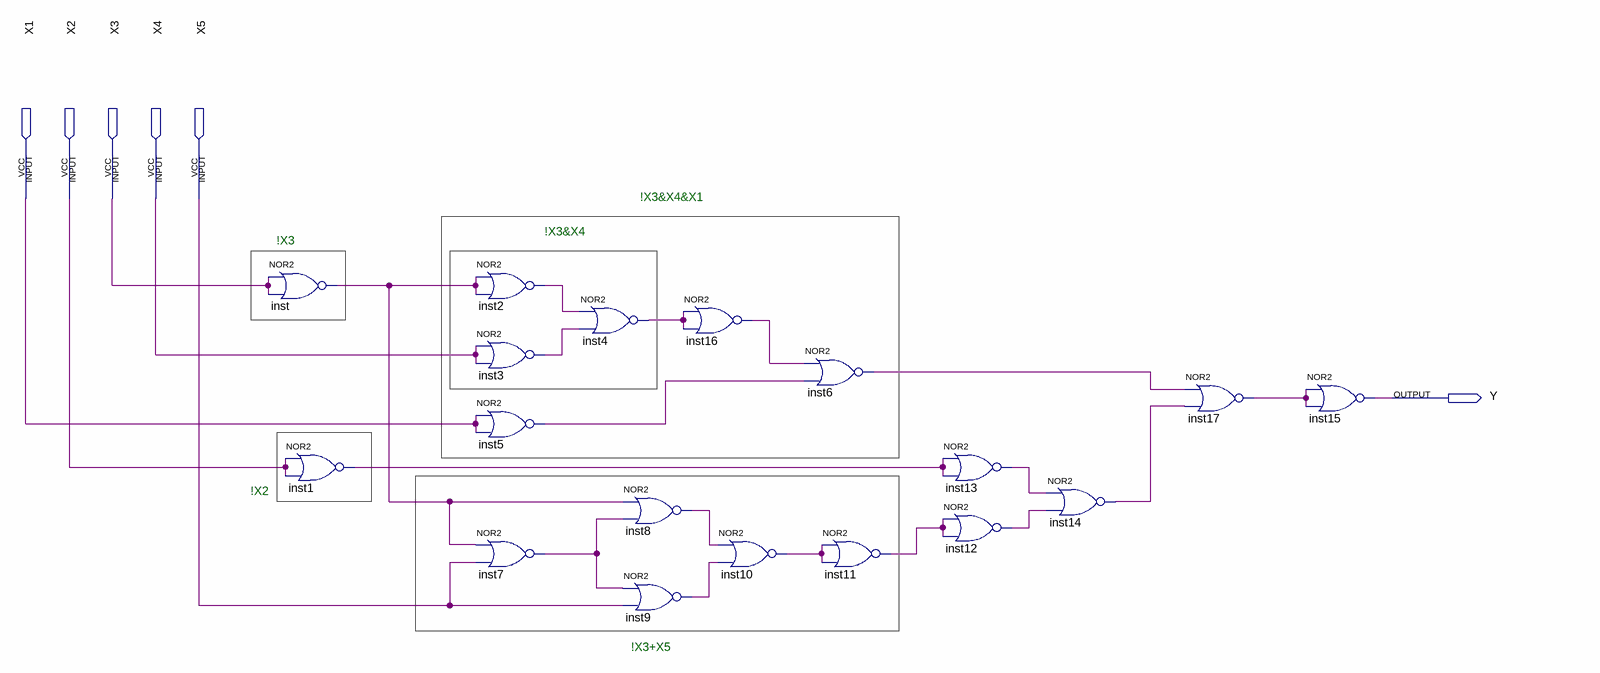
[diagram p0: schematic sheet]
// Quartus schematic part2.bdf as structural Verilog: 18 symbols, 6 pins
module part2 (
  input  X1,
  input  X2,
  input  X3,
  input  X4,
  input  X5,
  output Y
);

  wire inst1_out, inst2_out, inst3_out, inst4_out, inst5_out, inst6_out, inst7_out, inst8_out, inst9_out,
       inst10_out, inst11_out, inst12_out, inst13_out, inst14_out, inst16_out, inst17_out, inst_out;

  nor inst (inst_out, X3, X3);
  nor inst1 (inst1_out, X2, X2);
  nor inst2 (inst2_out, inst_out, inst_out);
  nor inst3 (inst3_out, X4, X4);
  nor inst5 (inst5_out, X1, X1);
  nor inst7 (inst7_out, inst_out, X5);
  nor inst4 (inst4_out, inst2_out, inst3_out);
  nor inst16 (inst16_out, inst4_out, inst4_out);
  nor inst8 (inst8_out, inst_out, inst7_out);
  nor inst9 (inst9_out, inst7_out, X5);
  nor inst10 (inst10_out, inst8_out, inst9_out);
  nor inst6 (inst6_out, inst16_out, inst5_out);
  nor inst11 (inst11_out, inst10_out, inst10_out);
  nor inst13 (inst13_out, inst1_out, inst1_out);
  nor inst12 (inst12_out, inst11_out, inst11_out);
  nor inst14 (inst14_out, inst13_out, inst12_out);
  nor inst17 (inst17_out, inst6_out, inst14_out);
  nor inst15 (Y, inst17_out, inst17_out);

  // Notes on the sheet:
  //   !X3&X4&X1
  //   !X3&X4
  //   !X3
  //   !X2
  //   !X3+X5
endmodule
